# Altium schematic sheet EEPROM.SchDoc
size A4; SheetNumber: 13; SheetTotal: 15
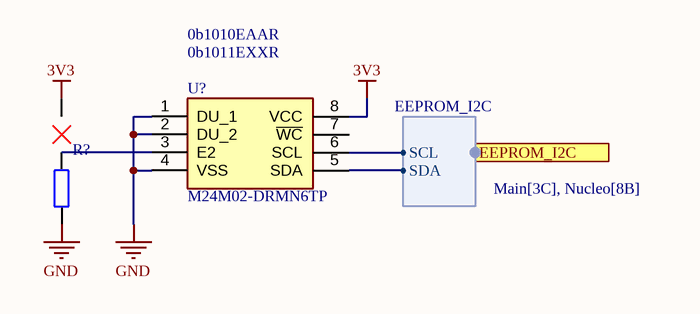
[diagram p0: EEPROM.SchDoc]

## Parts
R?  *  [RES0603 _SELECTION]  (value not drawn)
U?  M24M02-DRMN6TP  [SOIC127P600X175-8N]

## Ports
EEPROM_I2C (harness EEPROM_I2C, see Main[3C], Nucleo[8B])

## Harnesses
EEPROM_I2C: SCL, SDA

## Nets
3V3: R?.3 U?.8(VCC)
GND: R?.1 U?.1(DU_1) U?.2(DU_2) U?.4(VSS)
NetR?_2: R?.2 U?.3(E2)
NetU?_5: U?.5(SDA) ; port EEPROM_I2C.SDA
NetU?_6: U?.6(SCL) ; port EEPROM_I2C.SCL

Not connected (* = marked no-connect by the designer): U? 7(~{WC})

## Notes on the sheet
- 0b1010EAAR
- (near U?) 0b1011EXXR
- Size
- Date
- A4
- Title
- Sheet number
- Author
- Revision

## Library data of the parts
R? = Resistor_Selection: Resistor; Value: *
U? = M24M02-DRMN6TP: Undefined or Miscellaneous; Manufacturer_Name: STMicroelectronics; Datasheet Link: http://www.st.com/content/ccc/resource/technical/document/datasheet/b7/de/9b/f6/03/28/4e/8e/CD00290537.pdf/files/CD00290537.pdf/jcr:content/translations/en.CD00290537.pdf; Height: 1.75mm; Manufacturer_Part_Number: M24M02-DRMN6TP; Mouser Part Number: 511-M24M02-DRMN6TP; Mouser Price/Stock: https://www.mouser.co.uk/ProductDetail/STMicroelectronics/M24M02-DRMN6TP?qs=0gj%2FgiofzsPtgZ8EdVfF5w%3D%3D; Arrow Part Number: M24M02-DRMN6TP; Arrow Price/Stock: https://www.arrow.com/en/products/m24m02-drmn6tp/stmicroelectronics?utm_currency=USD&region=nac